# EAGLE design supply (EAGLE 9.4.2)
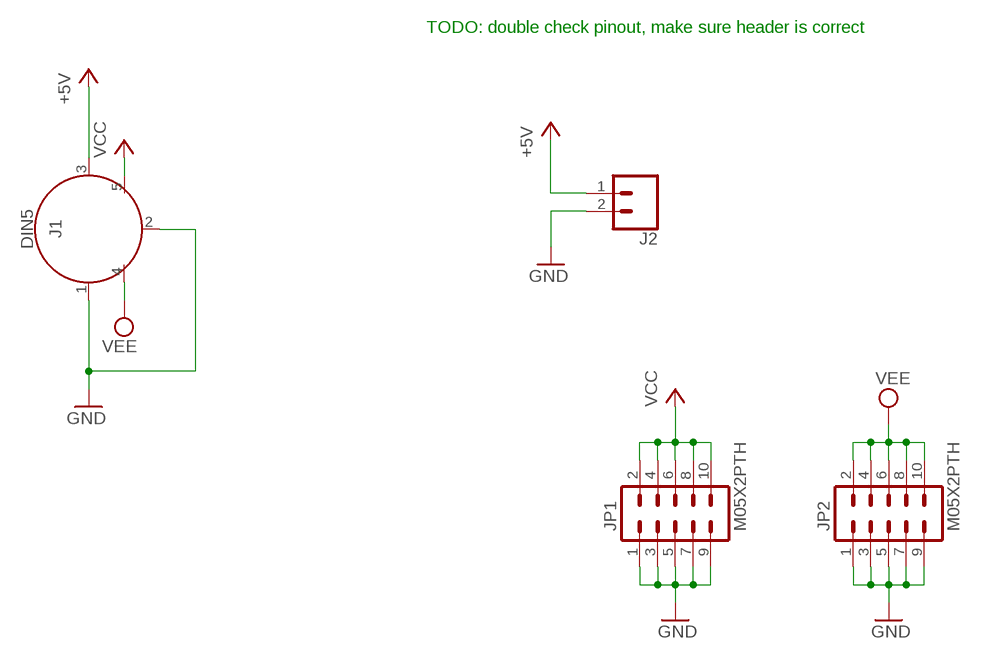
[diagram p0: schematic, sheet 1]

## Parts
J1  DIN5  [DIN5-RA-PTH]
J2  CONN_02  [1X02]
JP1  M05X2PTH  [AVR_ICSP]
JP2  M05X2PTH  [AVR_ICSP]

## Nets
+5V: J1.3 J2.1
GND: J1.1 J1.2 J2.2 JP1.1 JP1.3 JP1.5 JP1.7 JP1.9 JP2.1 JP2.3 JP2.5 JP2.7 JP2.9
VCC: J1.5 JP1.2 JP1.4 JP1.6 JP1.8 JP1.10
VEE: J1.4 JP2.2 JP2.4 JP2.6 JP2.8 JP2.10

## Notes on the sheet
- TODO: double check pinout, make sure header is correct

## Library data of the parts
J1 = SparkFun-Connectors:DIN5: DIN5 Connector - Female Right Angle (frequently used as a MIDI Jack connector) This type of connector and cable is frequently used for transmitting midi data (musical instrument digital interface). It is what you usually see on a keyboard or set of electronic drums. Learn more here <https://en.wikipedia.org/wiki/MIDI>. For more information on the pinout and electrical specifications of MIDI communications, please see the following resource: https://www.midi.org/specifications/item/midi-din-electrical-specification Here is the connector we sell at SparkFun: MIDI Connector - Female Right Angle <https://www.sparkfun.com/products/9536> (PRT-09536) Datasheet <hhttp://www.sparkfun.com/datasheets/Prototyping/Connectors/MIDI-RA.pdf> It is used on this SparkFun product: SparkFun MIDI Shield <https://www.sparkfun.com/products/12898> (DEV-12898); PROD_ID: CONN-09481
J2 = SparkFun-Connectors:CONN_02: Multi connection point. Often used as Generic Header-pin footprint for 0.1 inch spaced/style header connections On any of the 0.1 inch spaced packages, you can populate with these: Break Away Headers - Straight <https://www.sparkfun.com/products/116> (PRT-00116) Break Away Male Headers - Right Angle <https://www.sparkfun.com/products/553> (PRT-00553) Female Headers <https://www.sparkfun.com/products/115> (PRT-00115) Break Away Headers - Machine Pin <https://www.sparkfun.com/products/117> (PRT-00117) Break Away Female Headers - Swiss Machine Pin <https://www.sparkfun.com/products/743> (PRT-00743) For SCREWTERMINALS and SPRING TERMINALS visit here: Screw Terimnals on SparkFun.com <https://www.sparkfun.com/search/results?term=Screw+Terminals> (5mm/3.5mm/2.54mm spacing) This device is also useful as a general connection point to wire up your design to another part of your project. Our various solder wires solder well into these plated through hole pads. Hook-Up Wire - Assortment (Stranded, 22 AWG) <https://www.sparkfun.com/products/11375> (PRT-11375) Hook-Up Wire - Assortment (Solid Core, 22 AWG) <https://www.sparkfun.com/products/11367> (PRT-11367) View the entire wire category on our website here <https://www.sparkfun.com/categories/141> Special notes: Molex polarized connector foot print use with: PRT-08233 with associated crimp pins and housings. 2.54_SCREWTERM for use with PRT-10571. 3.5mm Screw Terminal footprints for PRT-08084 5mm Screw Terminal footprints for use with PRT-08432
JP1 JP2 = SparkFun:M05X2: Header 5x2 Standard 10-pin dual row 0.1" header. Commonly used with AVR-ISP. Use with Spark Fun Electronics SKU: PRT-00778

## Board
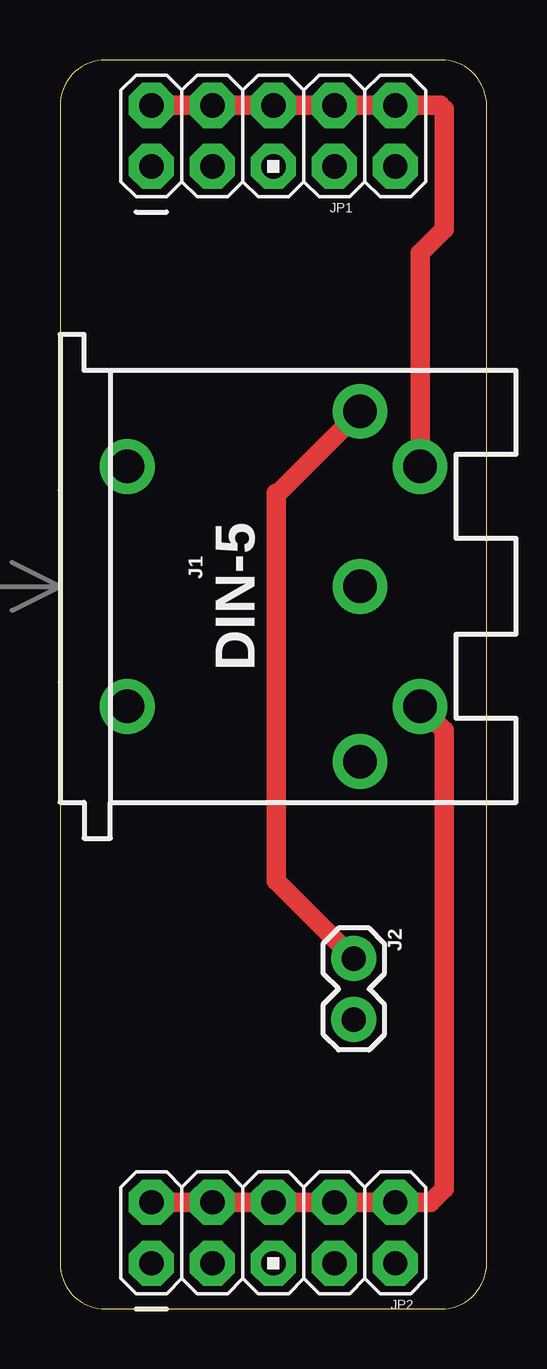
[diagram p1: board, top side]
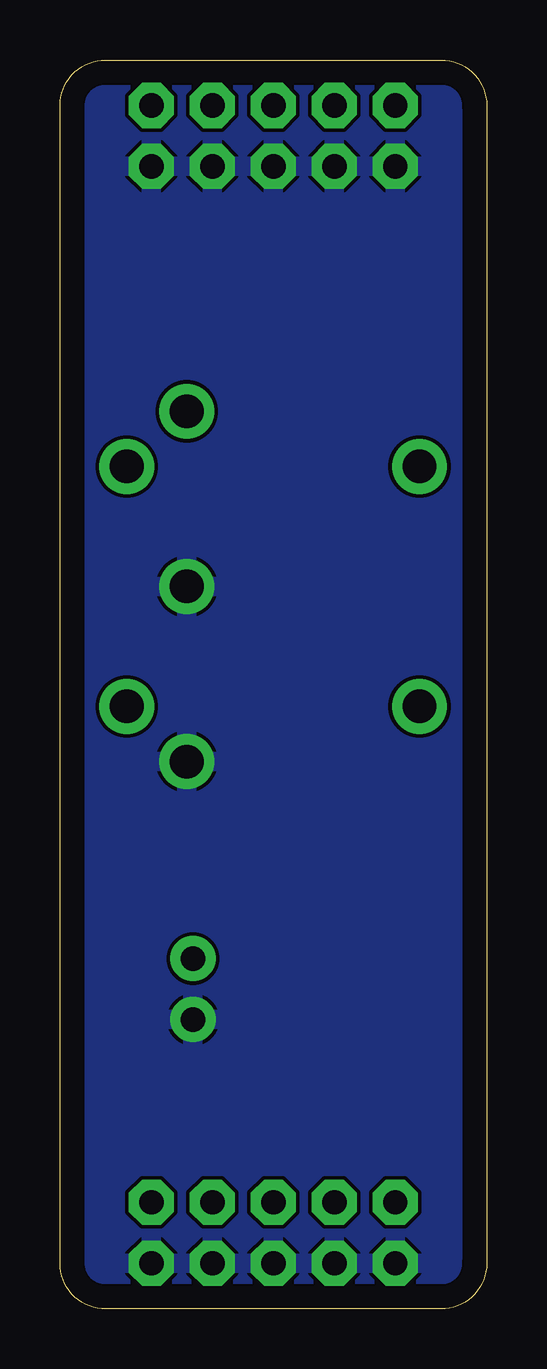
[diagram p2: board, bottom side, seen from below]

Size 17.78 x 52.06 mm. Coordinates in mm from the lower left corner, seen from the top.
Outline: 1.9,52.06 arc90 0,50.16 0,1.91 arc90 1.91,0 15.88,0 arc90 17.78,1.91 17.78,50.16 arc90 15.88,52.06 1.9,52.06
Copper layers (1*16): Top 0.035mm / dielectric 1.5mm / Bottom 0.035mm
Design rules "default": minimum track width 6mil, minimum drill 0.35mm, track to track 6mil, track to pad 6mil, pad to pad 6mil, via to via 6mil, smd to smd 6mil, copper to edge 40mil, drill to drill 6mil, minimum pad ring 10mil, minimum via ring 8mil, stop-mask expansion 4mil, vias tented up to drill 0mil, thermal gap 10mil

### Footprints (pad centres in the part's own frame; a part is rotated, then mirrored left to right if it is on the bottom)
DIN5-RA-PTH = drill 1.4 pad 2.286: 1 7.3,12.5; 2 0,12.5; 3 -7.3,12.5; 4 5,15; 5 -5,15; 6 -5,2.8; 7 5,2.8
1X02 = drill 1.016 pad 1.88: 1 0,0; 2 2.54,0
AVR_ICSP = drill 1.016 pad 1.88 octagon: 1 -1.27,5.08; 2 1.27,5.08; 3 -1.27,2.54; 4 1.27,2.54; 5 -1.27,0; 6 1.27,0; 7 -1.27,-2.54; 8 1.27,-2.54; 9 -1.27,-5.08; 10 1.27,-5.08

### Placement (x,y rotation side)
J1  0,30.11 270 top
J2  12.24,14.61 270 top
JP1  8.89,48.9 90 top
JP2  8.89,3.17 90 top

### Tracks (layer width: path | path; a pad name or v marks a point on that pad's centre or on a via)
+5V
  Top 0.813: J2.1 9,17.84 9,34 9.09,34 J1.3
GND
  pour Bottom: -1,53 -1,-1 19,-1 19,53
GND1
  pour Bottom: 1.91,52.07 arc90 0,50.16 0,1.91 arc90 1.91,0 15.88,0 arc90 17.78,1.91 17.78,50.16 arc90 15.88,52.07
VCC
  Top 0.813: J1.5 15,44 16,45 16,50 15.84,50.16 JP1.10 JP1.8 JP1.6 JP1.4 JP1.2
VEE
  Top 0.813: 14.88,25 J1.4 16,24.11 16,5 15.45,4.45 JP2.10 JP2.8 JP2.6 JP2.4 | 6,4.79 JP2.4 | JP2.4 JP2.2

### Text on the board
tValues: +5v | GND